# Altium schematic sheet mainboard.SchDoc
size 297 x 210 mm
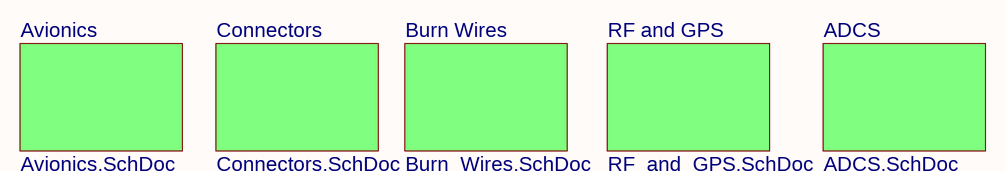
[diagram p0: mainboard.SchDoc]

## Sub-sheets
ADCS = ADCS.SchDoc: no entries
Avionics = Avionics.SchDoc: no entries
Burn Wires = Burn_Wires.SchDoc: no entries
Connectors = Connectors.SchDoc: no entries
RF and GPS = RF_and_GPS.SchDoc: no entries

## Notes on the sheet
- 1
- 2
- 3
- 4
- 5
- 6
- A
- B
- C
- D
- Title: PyCubed Mainboard
- File: mainboard.sch
- Sheet: /
- Max Holliday
- KiCad E.D.A.  kicad (5.1.4)-1
- Size: A4
- Date: 2020-02-10
- Rev: v04
- Id: 1/6